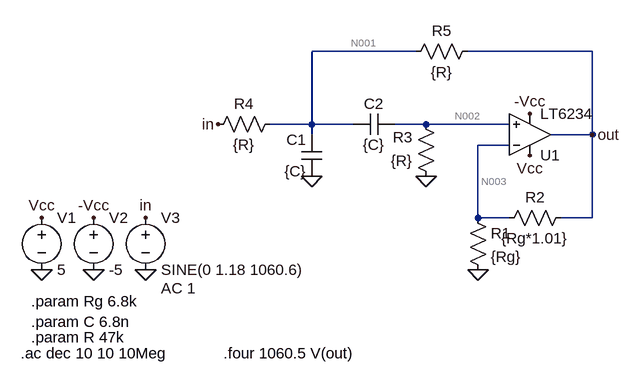
[diagram p0: schematic Etaj2.asc]
* Etaj2.asc
R3 0 N002 {R}
R4 in N001 {R}
C1 0 N001 {C}
C2 N001 N002 {C}
* U1: LT6234 (symbol OpAmps\LT6234 not available, pins judged from their places): In+=N002 In-=N003 V+=Vcc V-=-Vcc OUT=out
R1 N003 0 {Rg}
R2 out N003 {Rg*1.01}
R5 out N001 {R}
V1 Vcc 0 5
V2 -Vcc 0 -5
V3 in 0 SINE(0 1.18 1060.6) AC 1
.param Rg 6.8k
.param R 47k
.param C 6.8n
.ac dec 10 10 10Meg
.four 1060.5 V(out)
.backanno
.end

* Results of the author's LTspice run, read from the files saved beside the schematic
* Operating Point, zero values left out:
*   V(n002) = -70.34 mV
*   V(n001) = -65.55 mV
*   V(out) = -131.1 mV
*   V(-vcc) = -5 V
*   V(vcc) = 5 V
*   V(n003) = -70.34 mV
*   I(R3) = 1.497 µA
*   I(R4) = 1.395 µA
*   I(R1) = -10.34 µA
*   I(R2) = -8.848 µA
*   I(R5) = -1.395 µA
*   I(V1) = -1.035 mA
*   I(V2) = 1.048 mA
*   I(V3) = -1.395 µA
*   Ix(u1:1) = 1.497 µA
*   Ix(u1:2) = 1.497 µA
*   Ix(u1:3) = 10.24 µA
*   Ix(u1:4) = 1.035 mA
*   Ix(u1:5) = -1.048 mA
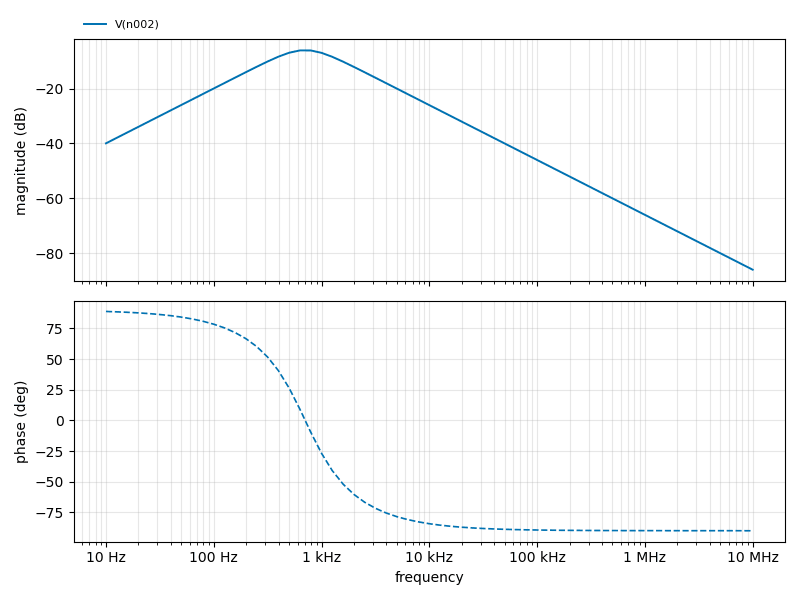
[diagram p1: AC Analysis of Etaj2.asc, plotted from the saved traces]
* AC Analysis, 1 run:
*   V(n002): -39.99 dB at 10 Hz, -86.07 dB at 10 MHz, peak -6.11 dB at 631 Hz, 3 dB below the peak at 361.8 Hz and 1.373 kHz